# Altium schematic sheet Analog Input.SchDoc: Analog Input
size A4; SheetNumber: 2; SheetTotal: 5
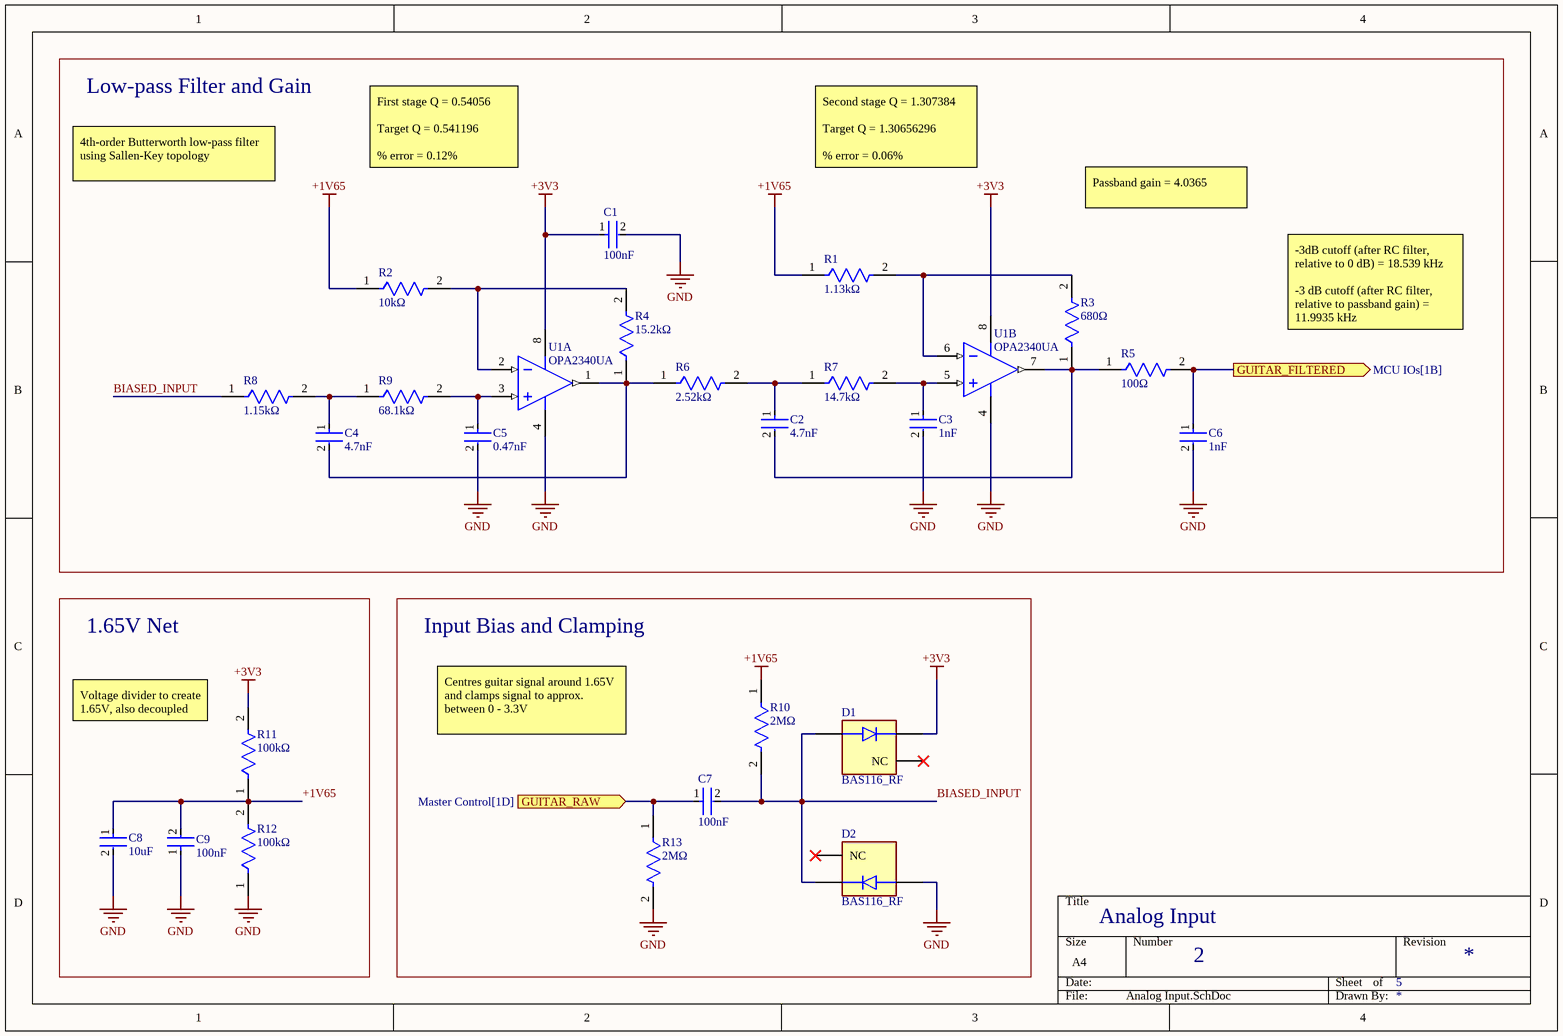
[diagram p0: Analog Input.SchDoc]

## Parts
C1  100nF  [FP-CC0603-DA-MFG]
C2  4.7nF  [FP-C0603C-CF-MFG]
C3  1nF  [FP-C0603C-CF-MFG]
C4  4.7nF  [FP-C0603C-CF-MFG]
C5  0.47nF  [FP-C0603C-CF-MFG]
C6  1nF  [FP-C0603C-CF-MFG]
C7  100nF  [FP-C1206C104F3GAC-MFG]
C8  10uF  [FP-CC0603-DC-MFG]
C9  100nF  [FP-CC0603-DA-MFG]
D1  BAS116_RF  [SOT95P237X112-3N]
D2  BAS116_RF  [SOT95P237X112-3N]
R1  1.13kΩ  [FP-RN73R1J-IPC_C]
R2  10kΩ  [FP-RT0603-MFG]
R3  680Ω  [FP-RT0603-MFG]
R4  15.2kΩ  [FP-RN73R1J-IPC_C]
R5  100Ω  [FP-RT0603-MFG]
R6  2.52kΩ  [FP-TFCR0603-MFG]
R7  14.7kΩ  [FP-RT0603-MFG]
R8  1.15kΩ  [FP-RN73R1J-IPC_A]
R9  68.1kΩ  [FP-RT0603-MFG]
R10  2MΩ  [FP-AC0603-IPC_A]
R11  100kΩ  [FP-RQ731J-IPC_C]
R12  100kΩ  [FP-RQ731J-IPC_C]
R13  2MΩ  [FP-AC0603-IPC_A]
U1  OPA2340UA  [D0008A_L]  (parts A,B of 2)

## Blocks framed on the sheet
Low-pass Filter and Gain: C1-C6 R1-R9 U1
1.65V Net: C8 C9 R11 R12
Input Bias and Clamping: C7 D1 D2 R10 R13

## Ports
GUITAR_FILTERED (out, see MCU IOs[1B]), GUITAR_RAW (in, see Master Control[1D])

## Nets
+1V65: C8.1 C9.2 R1.1 R2.1 R10.1 R11.1 R12.2
+3V3: C1.1 D1.3(K) R11.2 U1.8(V+)
GND: C1.2 C3.2 C5.2 C6.2 C8.2 C9.1 D2.1(A) R12.1 R13.2 U1.4(V-)
BIASED_INPUT: C7.2 D1.1(A) D2.3(K) R8.1 R10.2
GUITAR_FILTERED: C6.1 R5.2 ; port GUITAR_FILTERED
GUITAR_RAW: C7.1 R13.1 ; port GUITAR_RAW
NetC2_1: C2.1 R6.2 R7.1
NetC2_2: C2.2 R3.1 R5.1 U1.7(OUT_B)
NetC3_1: C3.1 R7.2 U1.5(IN_B+)
NetC4_1: C4.1 R8.2 R9.1
NetC4_2: C4.2 R4.1 R6.1 U1.1(OUT_A)
NetC5_1: C5.1 R9.2 U1.3(IN_A+)
NetR1_2: R1.2 R3.2 U1.6(IN_B-)
NetR2_2: R2.2 R4.2 U1.2(IN_A-)

Not connected (* = marked no-connect by the designer): D1 2(NC)*; D2 2(NC)*

## Notes on the sheet
- 4th-order Butterworth low-pass filter using Sallen-Key topology
- First stage Q = 0.54056
  Target Q = 0.541196
  % error = 0.12%
- Second stage Q = 1.307384
  Target Q = 1.30656296
  % error = 0.06%
- Passband gain = 4.0365
- -3dB cutoff (after RC filter, relative to 0 dB) = 18.539 kHz
  -3 dB cutoff (after RC filter, relative to passband gain) = 11.9935 kHz
- (near R11) Voltage divider to create 1.65V, also decoupled
- Centres guitar signal around 1.65V and clamps signal to approx. between 0 - 3.3V

## Library data of the parts
C1 C9 = CMP-03422-000081-1: CC0603 100 nF X7R 10.00% 25 V; Manufacturer Part Number: CC0603KPX7R8BB104; Manufacturer: YAGEO; Voltage: 25 V; Material: Ceramic; Tolerance: 0.1; Temperature Coefficient: 15%; Package: CC0603-DA; Capacitance: 100 nF; Device Class L2: Capacitors; Temperature Range High: +125°C; Automotive: No; Temperature Range Low: -55°C; Value: 100 nF; Device Class L1: Passive Components; Height: 0.9mm; RoHS: TRUE; Mouser Description: Multilayer Ceramic Capacitors MLCC - SMD/SMT 100nF 25V X7R 10%; Temperature Characteristic: X7R; Footprint Url: http://www.yageo.com/exep/pages/download/literatures/UPY-C_GEN_24.pdf; Octopart: https://octopart.com/cc0603kpx7r8bb104-yageo-12885111; Category: Cap; ComponentLink2Description: Datasheet; Voltage Rating: 25 V; Temperature: -55°C to +125°C; Device Class L3: Ceramic Capacitors; ComponentLink2URL: http://www.yageo.com/documents/recent/UPY-GPHC_X7R_6.3V-to-50V_18.pdf; Lead Free: Yes
C2 C4 = CMP-1035-02200-3: CAP CER 4700PF 50V 1% NP0 0603; Manufacturer: KEMET; Manufacturer Part Number: C0603C472F5GACTU; Tolerance: 0.01; Temperature Characteristic: C0G; Capacitance: 4,700 pF; Automotive Grade: Grade 1; Temperature Coefficient: 30ppm/°C; Value: 4,700 pF; Material: Ceramic; Device Class L1: Passive Components; Device Class L3: Ceramic Capacitors; Device Class L2: Capacitors; ComponentLink2Description: Datasheet; Voltage Rating: 50 V; Package: C0603C-CF; Octopart: https://octopart.com/c0603c472f5gactu-kemet-19050072; Height: 0.87mm; Lead Free: Yes; Mouser Description: Multilayer Ceramic Capacitors MLCC - SMD/SMT 50volts 4700pF 1% C0G; Category: Cap; ComponentLink2URL: https://api.kemet.com/component-edge/download/datasheet/C0603C100J5GACAUTO.pdf; Temperature: -55°C to +125°C; Temperature Range Low: -55°C; Digikey Description: CAP CER 4700PF 50V 1% NP0 0603; RoHS: TRUE; Temperature Range High: +125°C; Automotive: Yes
C3 = CMP-03020-010881-2: CAP CER 1000PF 100V C0G/NP0 0603; Manufacturer: KEMET; Manufacturer Part Number: C0603C102F1GAC7867; Temperature Characteristic: C0G; Tolerance: 0.01; Capacitance: 1,000 pF; Value: 1,000 pF; Material: Ceramic; Automotive Grade: Grade 1; Temperature Coefficient: 30ppm/°C; RoHS: TRUE; Temperature Range High: +125°C; Octopart: https://octopart.com/c0603c102f1gac7867-kemet-25528596; ComponentLink2URL: https://api.kemet.com/component-edge/download/datasheet/C0603C100J5GACAUTO.pdf; Lead Free: Yes; ComponentLink2Description: Datasheet; Automotive: Yes; Temperature Range Low: -55°C; Device Class L3: Ceramic Capacitors; Height: 0.87mm; Device Class L2: Capacitors; Voltage Rating: 100 V; Digikey Description: CAP CER 1000PF 100V C0G/NP0 0603; Package: C0603C-CF; Device Class L1: Passive Components; Temperature: -55°C to +125°C; Category: Cap
C5 = CMP-03020-027223-2: C0603 470 pF C0G 30ppm/°C 1.00% 50 V; Manufacturer: KEMET; Manufacturer Part Number: C0603C471F5GAC; Voltage Rating: 50 V; Automotive Grade: Grade 1; Value: 470 pF; Material: Ceramic; Tolerance: 0.01; Temperature Range Low: -55°C; Height: 0.87mm; Automotive: Yes; Temperature Range High: +125°C; Temperature Characteristic: C0G; Package: C0603C-CF; Device Class L1: Passive Components; ComponentLink2Description: Datasheet; Category: Cap; RoHS: TRUE; Temperature Coefficient: 30ppm/°C; ComponentLink2URL: https://api.kemet.com/component-edge/download/datasheet/C0603C100J5GACAUTO.pdf; Device Class L3: Ceramic Capacitors; Temperature: -55°C to +125°C; Capacitance: 470 pF; Mouser Description: Cap Ceramic 470pF 50V C0G 1% Pad SMD 0603 125C Bulk; Device Class L2: Capacitors; Lead Free: Yes; Octopart: https://octopart.com/c0603c471f5gac-kemet-9143462
C6 = CMP-03020-002782-2: C0603 1,000 pF C0G 30ppm/°C 1.00% 25 V; Manufacturer Part Number: C0603C102F3GAC; Manufacturer: KEMET; Material: Ceramic; Tolerance: 0.01; Automotive Grade: Grade 1; Voltage Rating: 25 V; Height: 0.87mm; Lead Free: Yes; Capacitance: 1,000 pF; ComponentLink2URL: https://api.kemet.com/component-edge/download/datasheet/C0603C100J5GACAUTO.pdf; Device Class L3: Ceramic Capacitors; Temperature Coefficient: 30ppm/°C; Automotive: Yes; Value: 1,000 pF; Octopart: https://octopart.com/c0603c102f3gac-kemet-9143535; Device Class L2: Capacitors; Category: Cap; Mouser Description: Multilayer Ceramic Capacitors MLCC - SMD/SMT 25volts 1000pF 1% C0G; Temperature: -55°C to +125°C; ComponentLink2Description: Datasheet; Temperature Characteristic: C0G; Device Class L1: Passive Components; Temperature Range Low: -55°C; Package: C0603C-CF; RoHS: TRUE; Temperature Range High: +125°C
C7 = CMP-03020-034715-1: 0.1 µF ±1% 25V Ceramic Capacitor C0G, NP0 1206 (3216 Metric); RoHS Compliant: Yes
C8 = CMP-00621-81932632-1: CC0603KRX5R7BB106 Multilayer Ceramic Capacitor, 10 uF, 16 V, ± 10%, X5R, 0603 [1608 Metric]; Capacitance: 10µF; Voltage Rating: 16V; NexarPartId: 81932632; Height: 1mm; Halogen Free: Halogen Free; Dielectric: X5R; Max Operating Temperature: 85°C; Voltage Rating (DC): 16V; Material: Ceramic; Lead Free: Lead Free; Tolerance: 10%; RoHS: Non-Compliant; Min Operating Temperature: -55°C; Case/Package: 0603
D1 D2 = BAS116_RF: MF: {'manufacturer': u'Taiwan Semiconductor'}; MP: BAS116 RFG; Package: None; Price: None; Value: *; Availability: Unavailable
R1 = CMP-04015-024131-1: 1.13kΩ ±0.05% 0.1W, 1/10W Chip Resistor 0603 (1608 Metric) Moisture Resistant Thin Film
R2 = CMP-03412-024743-1: RES SMD 10K OHM 0.05% 1/10W 0603; Manufacturer: Yageo; Manufacturer Part Number: RT0603WRE0710KL; Power Rating: 0.1W; Voltage Rating: 75V; Tolerance: 0.0005; Temperature Coefficient: 50 ppm/°C; Height: 0.55mm; ComponentLink2URL: http://www.yageo.com/documents/recent/PYu-RT_1-to-0.01_RoHS_L_9.pdf; Mouser Description: Res SMD 10K Ohm 0.05% 1/10W 0603; Device Class L1: Passive Components; Octopart: https://octopart.com/rt0603wre0710kl-yageo-71396825; Lead Free: Yes; RoHS: TRUE; ComponentLink2Description: Datasheet; Package: RT0603; Ipc Land Pattern Name: RESC16080X45; Automotive: No; Temperature: -55°C to +155°C; Value: 10KΩ; Series: RT; Resistance: 10KΩ; Footprint Url: http://www.yageo.com/exep/pages/download/literatures/PYu-R_Mount_10.pdf; Temperature Range Low: -55°C; Digikey Description: RES SMD 10K OHM 0.05% 1/10W 0603; Category: Res; Device Class L3: Chip SMD Resistors; Temperature Range High: +155°C; Device Class L2: Resistors; Composition: Thin Film
R3 = CMP-03412-028845-1: RES SMD 680 OHM 0.05% 1/10W 0603; Manufacturer: Yageo; Manufacturer Part Number: RT0603WRD07680RL; Voltage Rating: 75V; Power Rating: 0.1W; Tolerance: 0.0005; Temperature Coefficient: 25 ppm/°C; Package: RT0603; Value: 680Ω; Resistance: 680Ω; RoHS: TRUE; Octopart: https://octopart.com/rt0603wrd07680rl-yageo-71396736; Digikey Description: RES SMD 680 OHM 0.05% 1/10W 0603; Ipc Land Pattern Name: RESC16080X45; Height: 0.55mm; Device Class L1: Passive Components; Series: RT; Temperature: -55°C to +155°C; Temperature Range High: +155°C; Temperature Range Low: -55°C; Lead Free: Yes; Composition: Thin Film; ComponentLink2URL: http://www.yageo.com/documents/recent/PYu-RT_1-to-0.01_RoHS_L_9.pdf; ComponentLink2Description: Datasheet; Footprint Url: http://www.yageo.com/exep/pages/download/literatures/PYu-R_Mount_10.pdf; Device Class L3: Chip SMD Resistors; Automotive: No; Category: Res; Device Class L2: Resistors
R4 = CMP-04015-019747-1: 15.2kΩ ±0.05% 0.1W, 1/10W Chip Resistor 0603 (1608 Metric) Moisture Resistant Thin Film
R5 = CMP-2000-04516-2: RES SMD 100 OHM 0.1% 1/10W 0603; Manufacturer: Yageo; Manufacturer Part Number: RT0603BRE07100RL; Temperature Coefficient: 50 ppm/°C; Power Rating: 0.1W; Voltage Rating: 75V; Tolerance: 0.001; Value: 100Ω; Lead Free: Yes; Ipc Land Pattern Name: RESC16080X45; Resistance: 100Ω; Package: RT0603; Device Class L1: Passive Components; Temperature Range High: +155°C; Height: 0.55mm; Automotive: No; Octopart: https://octopart.com/rt0603bre07100rl-yageo-1483384; Composition: Thin Film; Device Class L2: Resistors; Device Class L3: Chip SMD Resistors; Series: RT; Digikey Description: RES SMD 100 OHM 0.1% 1/10W 0603; RoHS: TRUE; ComponentLink2URL: http://www.yageo.com/documents/recent/PYu-RT_1-to-0.01_RoHS_L_9.pdf; Temperature Range Low: -55°C; Category: Res; Footprint Url: http://www.yageo.com/exep/pages/download/literatures/PYu-R_Mount_10.pdf; ComponentLink2Description: Datasheet; Temperature: -55°C to +155°C
R6 = CMP-250906-113146-1: RES Thin Film,  2.52kΩ, 0.1%, 0.1W, 50ppm/°C, 0603
R7 = CMP-03412-019103-1: RES SMD 14.7K OHM 1/10W 0603; Manufacturer Part Number: RT0603WRD0714K7L; Manufacturer: Yageo; Tolerance: 0.0005; Voltage Rating: 75V; Power Rating: 0.1W; Temperature Coefficient: 25 ppm/°C; Height: 0.55mm; Category: Res; Automotive: No; Footprint Url: http://www.yageo.com/exep/pages/download/literatures/PYu-R_Mount_10.pdf; Composition: Thin Film; ComponentLink2URL: http://www.yageo.com/documents/recent/PYu-RT_1-to-0.01_RoHS_L_9.pdf; Temperature: -55°C to +155°C; Temperature Range Low: -55°C; Lead Free: Yes; Series: RT; Temperature Range High: +155°C; Ipc Land Pattern Name: RESC16080X45; RoHS: TRUE; Resistance: 14.7KΩ; Digikey Description: RES SMD 14.7K OHM 1/10W 0603; Value: 14.7KΩ; Octopart: https://octopart.com/rt0603wrd0714k7l-yageo-71396410; Package: RT0603; ComponentLink2Description: Datasheet; Device Class L2: Resistors; Device Class L1: Passive Components; Device Class L3: Chip SMD Resistors
R8 = CMP-04015-014252-1: 1.15kΩ ±0.05% 0.1W, 1/10W Chip Resistor 0603 (1608 Metric) Moisture Resistant Thin Film
R9 = CMP-03412-006240-1: RES SMD 68.1K OHM 1/10W 0603; Manufacturer Part Number: RT0603WRE0768K1L; Manufacturer: Yageo; Temperature Coefficient: 50 ppm/°C; Tolerance: 0.0005; Power Rating: 0.1W; Voltage Rating: 75V; Height: 0.55mm; Footprint Url: http://www.yageo.com/exep/pages/download/literatures/PYu-R_Mount_10.pdf; Package: RT0603; Octopart: https://octopart.com/rt0603wre0768k1l-yageo-71397197; Device Class L3: Chip SMD Resistors; Device Class L2: Resistors; ComponentLink2URL: http://www.yageo.com/documents/recent/PYu-RT_1-to-0.01_RoHS_L_9.pdf; Ipc Land Pattern Name: RESC16080X45; Temperature Range High: +155°C; ComponentLink2Description: Datasheet; Value: 68.1KΩ; Resistance: 68.1KΩ; Digikey Description: RES SMD 68.1K OHM 1/10W 0603; Category: Res; Temperature Range Low: -55°C; Temperature: -55°C to +155°C; Composition: Thin Film; Device Class L1: Passive Components; Automotive: No; Series: RT; RoHS: TRUE; Lead Free: Yes
R10 R13 = CMP-03412-049830-1: RES 2MΩ 0.50% 0.1W 0603
R11 R12 = CMP-03211-001316-1: RQ73 0603 100KΩ  0.15W 10ppm/°C 0.1% 75V; Manufacturer: TE; Manufacturer Part Number: RQ73C1J100KBTD; Automotive Grade: Grade 0; Device Class L3: Chip SMD Resistors; Composition: Thin Film; Category: Res; Device Class L2: Resistors; Automotive: Yes; Temperature Range High: +155°C; Resistance: 100KΩ; Octopart: https://octopart.com/rq73c1j100kbtd-te+connectivity-93908182; Temperature Range Low: -55°C; Device Class L1: Passive Components; Tolerance: 0.1%; ComponentLink2Description: Datasheet; Temperature: -55°C to +155°C; Value: 100KΩ; Ipc Land Pattern Name: RESC15580X45; Series: RQ73; Package: RQ731J; ComponentLink2URL: https://www.te.com/commerce/DocumentDelivery/DDEController?Action=showdoc&DocId=Data+Sheet%7F1773270-2%7FA%7Fpdf%7FEnglish%7FENG_DS_1773270-2_A.pdf%7F4-2176362-2; Height: 0.6mm; Power Rating: 0.15W; Lead Free: Yes; Temperature Coefficient: 10ppm/°C; Voltage Rating: 75V; RoHS: TRUE
U1 = CMP-0272-00784-3: Single-Supply, Rail-to-Rail Operational Amplifier MicroAmplifier(TM) Series, 2.5 to 5.5 V, -40 to 85 degC, 8-pin SOIC (D8), Green (RoHS & no Sb/Br); Manufacturer: Texas Instruments; Iq per channel(Max)(mA): 0.95; CMRR(Min)(dB): 80; Slew Rate(Typ)(V/us): 6; Vio (25C)(Max)(mV): 0.5; IIB(Max)(pA): 10; Number of Channels: 2; Sub Family: Low Input Bias Current Amp (<=10pA), Low Offset Voltage Amplifier (<=500uV), Low Supply Voltage Amplifier (<=2.7V), Precision Amplifier; Offset Drift(Typ)(uV/C): 2.5; Vn at 1kHz(Typ)(nV/rtHz): 25; Total Supply Voltage(Max)(+5V is 5, +/-5V is 10): 5.5; Eco-Plan: Green (RoHS & no Sb/Br); PackageDescription: 8-Pin Plastic Small Outline, Body 4.9 x 3.9 mm, Pitch 1.27 mm; Code_JEDEC: MS-012; PartNumber: OPA2340UA; ComponentLink1URL: http://www.ti.com/; Mounting Technology: Surface Mount; ComponentLink1Description: Manufacturer URL; PackageReference: D0008A; ComponentLink2URL: http://www.ti.com/general/docs/lit/getliterature.tsp?genericPartNumber=OPA2340&fileType=pdf; ComponentLink2Description: Datasheet; ComponentLink3Description: Package Specification; PackageVersion: 4040047-3/M, 06/2011; Total Supply Voltage(Min)(+5V is 5, +/-5V is 10): 2.5; DatasheetVersion: SBOS073B; ComponentLink3URL: http://www.ti.com/litv/pdf/msoi002j